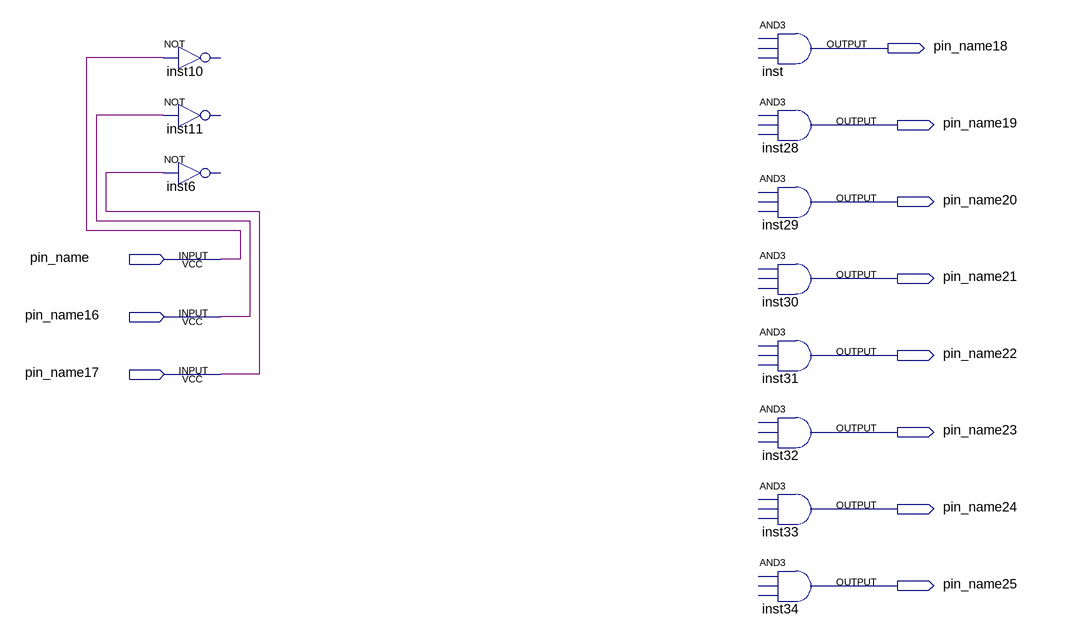
[diagram p0: schematic sheet]
// Quartus schematic No1.bdf as structural Verilog: 11 symbols, 11 pins
module No1 (
  input  pin_name,
  input  pin_name16,
  input  pin_name17,
  output pin_name18,
  output pin_name19,
  output pin_name20,
  output pin_name21,
  output pin_name22,
  output pin_name23,
  output pin_name24,
  output pin_name25
);

  // NOT inst10 has open pins: IN=pin_name, OUT=open
  // NOT inst11 has open pins: IN=pin_name16, OUT=open
  // NOT inst6 has open pins: IN=pin_name17, OUT=open
  // AND3 inst is placed but not wired
  // AND3 inst28 has open pins: IN1=open, IN2=open, IN3=open, OUT=pin_name19
  // AND3 inst29 has open pins: IN1=open, IN2=open, IN3=open, OUT=pin_name20
  // AND3 inst30 has open pins: IN1=open, IN2=open, IN3=open, OUT=pin_name21
  // AND3 inst31 has open pins: IN1=open, IN2=open, IN3=open, OUT=pin_name22
  // AND3 inst32 has open pins: IN1=open, IN2=open, IN3=open, OUT=pin_name23
  // AND3 inst33 has open pins: IN1=open, IN2=open, IN3=open, OUT=pin_name24
  // AND3 inst34 has open pins: IN1=open, IN2=open, IN3=open, OUT=pin_name25
endmodule
